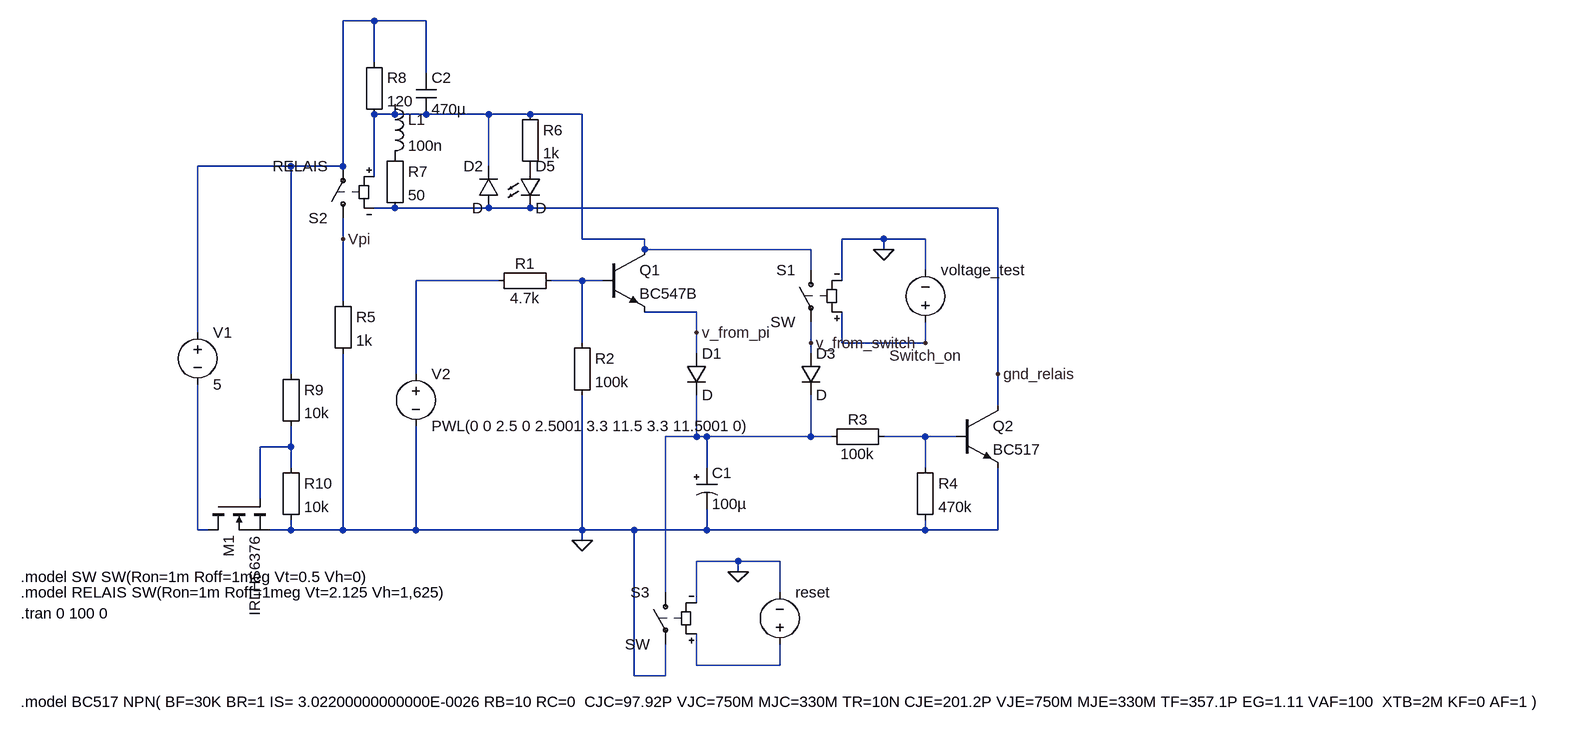
[diagram p0: schematic power.asc]
power.asc, the LTspice schematic file:
Version 4
SHEET 1 1896 712
WIRE 80 -352 32 -352
WIRE 160 -352 80 -352
WIRE 80 -288 80 -352
WIRE 160 -272 160 -352
WIRE 112 -208 112 -224
WIRE 112 -208 80 -208
WIRE 160 -208 112 -208
WIRE 256 -208 160 -208
WIRE 320 -208 256 -208
WIRE 400 -208 320 -208
WIRE -48 -128 -192 -128
WIRE 32 -128 32 -352
WIRE 32 -128 -48 -128
WIRE 256 -128 256 -208
WIRE 80 -112 80 -208
WIRE 112 -64 80 -64
WIRE 256 -64 112 -64
WIRE 320 -64 256 -64
WIRE 1040 -64 320 -64
WIRE 32 -16 32 -48
WIRE 400 -16 400 -208
WIRE 496 -16 400 -16
WIRE 864 -16 800 -16
WIRE 928 -16 864 -16
WIRE 496 0 496 -16
WIRE 752 0 496 0
WIRE 864 0 864 -16
WIRE 752 32 752 0
WIRE 928 32 928 -16
WIRE 272 48 144 48
WIRE 400 48 352 48
WIRE 432 48 400 48
WIRE 800 48 800 -16
WIRE 32 80 32 -16
WIRE 576 96 496 96
WIRE -192 128 -192 -128
WIRE 576 128 576 96
WIRE 400 144 400 48
WIRE 752 144 752 112
WIRE 800 144 800 96
WIRE 928 144 928 112
WIRE 928 144 800 144
WIRE 576 160 576 128
WIRE 752 160 752 144
WIRE -48 192 -48 -128
WIRE 144 192 144 48
WIRE 1040 192 1040 -64
WIRE 1040 240 1040 192
WIRE 576 288 576 224
WIRE 576 288 528 288
WIRE 592 288 576 288
WIRE 752 288 752 224
WIRE 752 288 592 288
WIRE 784 288 752 288
WIRE 928 288 864 288
WIRE 976 288 928 288
WIRE -48 304 -48 272
WIRE -48 304 -96 304
WIRE -48 336 -48 304
WIRE 592 336 592 288
WIRE 928 336 928 288
WIRE -96 384 -96 304
WIRE -192 432 -192 208
WIRE -176 432 -192 432
WIRE -48 432 -48 416
WIRE -48 432 -80 432
WIRE 32 432 32 160
WIRE 32 432 -48 432
WIRE 144 432 144 272
WIRE 144 432 32 432
WIRE 400 432 400 224
WIRE 400 432 144 432
WIRE 480 432 400 432
WIRE 592 432 592 400
WIRE 592 432 480 432
WIRE 928 432 928 416
WIRE 928 432 592 432
WIRE 1040 432 1040 336
WIRE 1040 432 928 432
WIRE 400 448 400 432
WIRE 640 480 576 480
WIRE 704 480 640 480
WIRE 640 496 640 480
WIRE 528 528 528 288
WIRE 704 528 704 480
WIRE 576 544 576 480
WIRE 576 640 576 592
WIRE 704 640 704 608
WIRE 704 640 576 640
WIRE 480 656 480 432
WIRE 528 656 528 608
WIRE 528 656 480 656
FLAG 864 0 0
FLAG 928 144 Switch_on
FLAG 32 -16 Vpi
FLAG 400 448 0
FLAG 640 496 0
FLAG 1040 192 gnd_relais
FLAG 576 128 v_from_pi
FLAG 752 144 v_from_switch
SYMBOL voltage 928 128 M180
WINDOW 0 24 96 Left 2
WINDOW 3 24 16 Invisible 2
WINDOW 123 0 0 Left 2
WINDOW 39 0 0 Left 2
SYMATTR InstName voltage_test
SYMATTR Value PWL(0 0 1 0 1.001 1 1.5 1 1.5001 0 10 0 10.001 1 10.5 1 10.5001 0 15 0)
SYMBOL sw 752 16 M0
SYMATTR InstName S1
SYMBOL sw 32 -32 R180
SYMATTR InstName S2
SYMATTR Value RELAIS
SYMBOL diode 560 160 R0
SYMATTR InstName D1
SYMBOL diode 736 160 R0
SYMATTR InstName D3
SYMBOL Misc\\EuropeanResistor 368 32 R90
WINDOW 0 5 56 VBottom 2
WINDOW 3 27 56 VTop 2
SYMATTR InstName R1
SYMATTR Value 4.7k
SYMBOL Misc\\EuropeanResistor 384 128 R0
SYMATTR InstName R2
SYMATTR Value 100k
SYMBOL Misc\\EuropeanResistor 880 272 R90
WINDOW 0 5 56 VBottom 2
WINDOW 3 27 56 VTop 2
SYMATTR InstName R3
SYMATTR Value 100k
SYMBOL Misc\\EuropeanResistor 912 320 R0
SYMATTR InstName R4
SYMATTR Value 470k
SYMBOL Misc\\EuropeanPolcap 576 336 R0
SYMATTR InstName C1
SYMATTR Value 100µ
SYMATTR SpiceLine V=10 Irms=3.87298 Rser=0.015 Lser=0
SYMBOL npn 432 0 R0
SYMATTR InstName Q1
SYMATTR Value BC547B
SYMBOL voltage -192 112 R0
WINDOW 123 0 0 Left 2
WINDOW 39 0 0 Left 2
SYMATTR InstName V1
SYMATTR Value 5
SYMBOL voltage 144 176 R0
WINDOW 123 0 0 Left 2
WINDOW 39 0 0 Left 2
SYMATTR InstName V2
SYMATTR Value PWL(0 0 2.5 0 2.5001 3.3 11.5 3.3 11.5001 0)
SYMBOL Misc\\EuropeanResistor 16 64 R0
SYMATTR InstName R5
SYMATTR Value 1k
SYMBOL voltage 704 624 M180
WINDOW 0 24 96 Left 2
WINDOW 3 24 16 Invisible 2
WINDOW 123 0 0 Left 2
WINDOW 39 0 0 Left 2
SYMATTR InstName reset
SYMATTR Value PWL(0 1 0.5 0)
SYMBOL sw 528 512 M0
SYMATTR InstName S3
SYMBOL Misc\\EuropeanResistor 304 -224 R0
SYMATTR InstName R6
SYMATTR Value 1k
SYMBOL npn 976 240 R0
SYMATTR InstName Q2
SYMATTR Value BC517
SYMBOL LED 304 -128 R0
SYMATTR InstName D5
SYMBOL diode 272 -64 R180
WINDOW 0 24 64 Left 2
WINDOW 3 24 0 Left 2
SYMATTR InstName D2
SYMBOL Misc\\EuropeanResistor 96 -160 R0
SYMATTR InstName R7
SYMATTR Value 50
SYMBOL Misc\\EuropeanResistor 64 -304 R0
SYMATTR InstName R8
SYMATTR Value 120
SYMBOL Misc\\EuropeanResistor -64 176 R0
SYMATTR InstName R9
SYMATTR Value 10k
SYMBOL Misc\\EuropeanResistor -64 320 R0
SYMATTR InstName R10
SYMATTR Value 10k
SYMBOL nmos -176 384 M90
SYMATTR InstName M1
SYMATTR Value IRLHS6376
SYMBOL ind 96 -240 R0
SYMATTR InstName L1
SYMATTR Value 100n
SYMBOL cap 144 -272 R0
SYMATTR InstName C2
SYMATTR Value 470µ
TEXT -464 560 Left 2 !.tran 0 100 0
TEXT -464 504 Left 2 !.model SW SW(Ron=1m Roff=1meg Vt=0.5 Vh=0)
TEXT -464 528 Left 2 !.model RELAIS SW(Ron=1m Roff=1meg Vt=2.125 Vh=1,625)
TEXT -464 696 Left 2 !.model BC517 NPN( BF=30K BR=1 IS= 3.02200000000000E-0026 RB=10 RC=0  CJC=97.92P VJC=750M MJC=330M TR=10N CJE=201.2P VJE=750M MJE=330M TF=357.1P EG=1.11 VAF=100  XTB=2M KF=0 AF=1 )

The netlist it stands for:
* power.asc
voltage_test Switch_on 0 PWL(0 0 1 0 1.001 1 1.5 1 1.5001 0 10 0 10.001 1 10.5 1 10.5001 0 15 0)
S1 N002 v_from_switch Switch_on 0 SW
S2 Vpi N001 N002 gnd_relais RELAIS
D1 v_from_pi N005 D
D3 v_from_switch N005 D
R1 N004 N003 4.7k
R2 N004 0 100k
R3 N006 N005 100k
R4 N006 0 470k
C1 N005 0 100µ V=10 Irms=3.87298 Rser=0.015 Lser=0
Q1 N002 N004 v_from_pi 0 BC547B
V1 N001 N008 5
V2 N003 0 PWL(0 0 2.5 0 2.5001 3.3 11.5 3.3 11.5001 0)
R5 Vpi 0 1k
V§reset N009 0 PWL(0 1 0.5 0)
S3 N005 0 N009 0 SW
R6 N002 P001 1k
Q2 gnd_relais N006 0 0 BC517
D5 P001 gnd_relais D
D2 gnd_relais N002 D
R7 P002 gnd_relais 50
R8 N001 N002 120
R9 N001 N007 10k
R10 N007 0 10k
M1 N008 N007 0 0 IRLHS6376
L1 N002 P002 100n
C2 N001 N002 470µ
.model D D
.lib standard.dio
.model NPN NPN
.model PNP PNP
.lib standard.bjt
.model NMOS NMOS
.model PMOS PMOS
.lib standard.mos
.tran 0 100 0
.model SW SW(Ron=1m Roff=1meg Vt=0.5 Vh=0)
.model RELAIS SW(Ron=1m Roff=1meg Vt=2.125 Vh=1,625)
.model BC517 NPN( BF=30K BR=1 IS= 3.02200000000000E-0026 RB=10 RC=0  CJC=97.92P VJC=750M MJC=330M TR=10N CJE=201.2P VJE=750M MJE=330M TF=357.1P EG=1.11 VAF=100  XTB=2M KF=0 AF=1 )
.backanno
.end